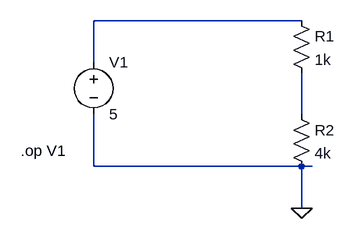
[diagram p0: schematic Draft1.asc]
Draft1.asc, the LTspice schematic file:
Version 4
SHEET 1 880 680
WIRE 256 96 -64 96
WIRE -64 160 -64 96
WIRE 256 240 256 176
WIRE -64 320 -64 240
WIRE 256 320 -64 320
WIRE 272 320 256 320
WIRE 256 384 256 320
FLAG 256 384 0
SYMBOL res 240 80 R0
SYMATTR InstName R1
SYMATTR Value 1k
SYMBOL res 240 224 R0
SYMATTR InstName R2
SYMATTR Value 4k
SYMBOL voltage -64 144 R0
SYMATTR InstName V1
SYMATTR Value 5
TEXT -176 296 Left 2 !.op V1

The netlist it stands for:
* Draft1.asc
R1 N001 N002 1k
R2 N002 0 4k
V1 N001 0 5
.op V1
.backanno
.end